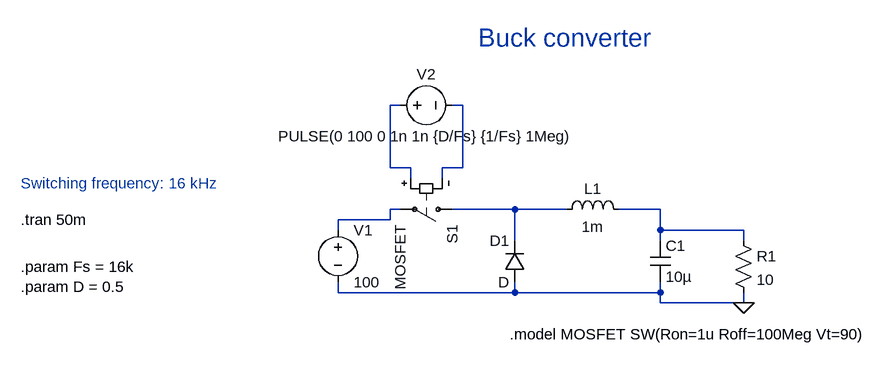
[diagram p0: schematic Buck-converter.asc]
Buck-converter.asc, the LTspice schematic file:
Version 4.1
SHEET 1 1244 680
WIRE 496 208 496 224
WIRE 272 208 272 224
WIRE 624 224 624 240
WIRE 0 208 0 224
WIRE 496 224 496 240
WIRE 496 240 624 240
WIRE 496 224 272 224
WIRE 272 224 0 224
FLAG 624 240 0
WIRE 112 48 112 32
WIRE 96 -64 80 -64
WIRE 112 32 80 32
WIRE 80 32 80 -64
WIRE 160 48 160 32
WIRE 176 -64 192 -64
WIRE 160 32 192 32
WIRE 192 32 192 -64
WIRE 96 96 80 96
WIRE 0 128 0 112
WIRE 80 96 80 112
WIRE 80 112 0 112
WIRE 272 144 272 128
WIRE 352 96 336 96
WIRE 176 96 192 96
WIRE 272 128 272 96
WIRE 272 96 336 96
WIRE 272 96 192 96
WIRE 496 144 496 128
WIRE 432 96 448 96
WIRE 624 144 624 128
WIRE 496 128 496 96
WIRE 496 96 448 96
WIRE 496 128 624 128
SYMBOL voltage 0 112 R0
WINDOW 123 0 0 Left 0
WINDOW 39 0 0 Left 0
SYMATTR InstName V1
SYMATTR Value 100
SYMBOL diode 288 208 R180
WINDOW 0 24 64 Left 2
WINDOW 3 24 0 Left 2
SYMATTR InstName D1
SYMBOL ind 336 112 R270
WINDOW 0 32 56 VTop 2
WINDOW 3 5 56 VBottom 2
SYMATTR InstName L1
SYMATTR Value 1m
SYMBOL cap 480 144 R0
SYMATTR InstName C1
SYMATTR Value 10µ
SYMBOL res 608 128 R0
SYMATTR InstName R1
SYMATTR Value 10
SYMBOL sw 192 96 R90
SYMATTR InstName S1
SYMATTR Value MOSFET
SYMBOL voltage 80 -64 R270
WINDOW 0 32 56 VTop 2
WINDOW 3 -32 56 VBottom 2
WINDOW 123 0 0 Left 0
WINDOW 39 0 0 Left 0
SYMATTR InstName V2
SYMATTR Value PULSE(0 100 0 1n 1n {D/Fs} {1/Fs} 1Meg)
TEXT -488 112 Left 2 !.tran 50m
TEXT 264 288 Left 2 !.model MOSFET SW(Ron=1u Roff=100Meg Vt=90)
TEXT -488 56 Left 2 ;Switching frequency: 16 kHz
TEXT -488 184 Left 2 !.param Fs = 16k\n.param D = 0.5
TEXT 216 -168 Left 4 ;Buck converter

The netlist it stands for:
* Buck-converter.asc
V1 N003 0 100
D1 0 N004 D
L1 N004 N005 1m
C1 N005 0 10µ
R1 N005 0 10
S1 N004 N003 N001 N002 MOSFET
V2 N001 N002 PULSE(0 100 0 1n 1n {D/Fs} {1/Fs} 1Meg)
.model D D
.lib standard.dio
.tran 50m
.model MOSFET SW(Ron=1u Roff=100Meg Vt=90)
* Switching frequency: 16 kHz
.param Fs = 16k
.param D = 0.5
* Buck converter
.backanno
.end